# Altium schematic sheet FT2232Circuit.SchDoc
size A3
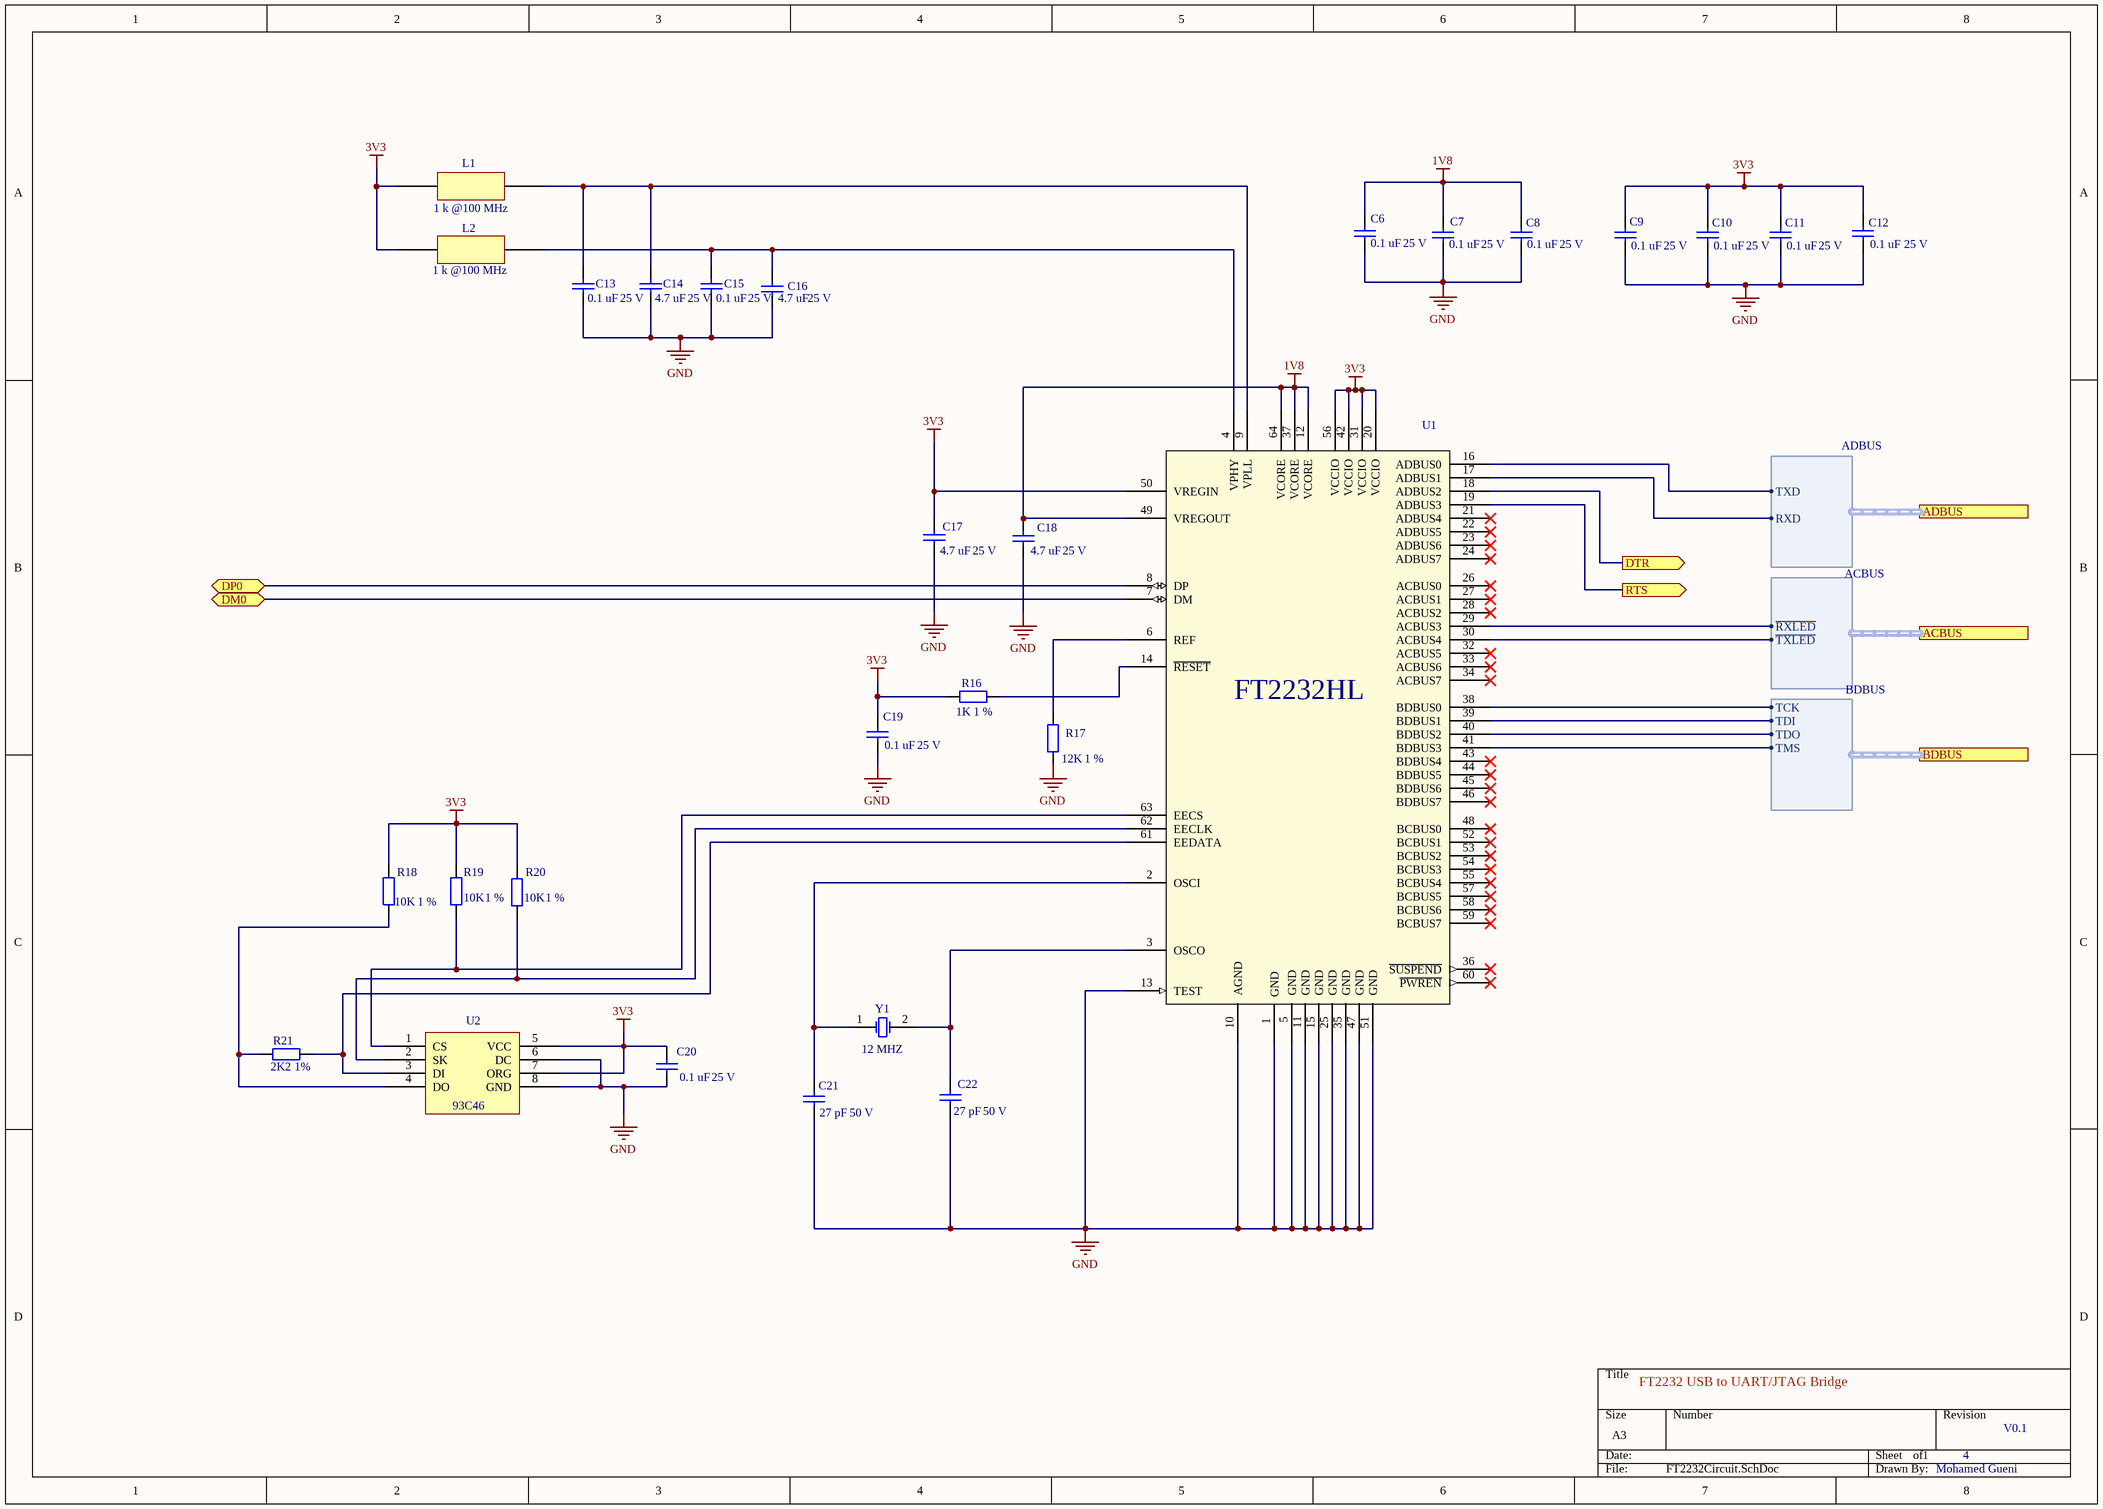
[diagram p0: FT2232Circuit.SchDoc]

## Parts
C6  Value 1: 0.1 uF  Value 2: 25 V  [CAP0603]  (hidden comment: Capacitor)
C7  Value 1: 0.1 uF  Value 2: 25 V  [CAP0603]  (hidden comment: Capacitor)
C8  Value 1: 0.1 uF  Value 2: 25 V  [CAP0603]  (hidden comment: Capacitor)
C9  Value 1: 0.1 uF  Value 2: 25 V  [CAP0603]  (hidden comment: Capacitor)
C10  Value 1: 0.1 uF  Value 2: 25 V  [CAP0603]  (hidden comment: Capacitor)
C11  Value 1: 0.1 uF  Value 2: 25 V  [CAP0603]  (hidden comment: Capacitor)
C12  Value 1: 0.1 uF  Value 2: 25 V  [CAP0603]  (hidden comment: Capacitor)
C13  Value 1: 0.1 uF  Value 2: 25 V  [CAP0603]  (hidden comment: Capacitor)
C14  Value 1: 4.7 uF  Value 2: 25 V  [CAP0603]  (hidden comment: Capacitor)
C15  Value 1: 0.1 uF  Value 2: 25 V  [CAP0603]  (hidden comment: Capacitor)
C16  Value 1: 4.7 uF  Value 2: 25 V  [CAP0603]  (hidden comment: Capacitor)
C17  Value 1: 4.7 uF  Value 2: 25 V  [CAP0603]  (hidden comment: Capacitor)
C18  Value 1: 4.7 uF  Value 2: 25 V  [CAP0603]  (hidden comment: Capacitor)
C19  Value 1: 0.1 uF  Value 2: 25 V  [CAP0603]  (hidden comment: Capacitor)
C20  Value 1: 0.1 uF  Value 2: 25 V  [CAP0603]  (hidden comment: Capacitor)
C21  Value 1: 27 pF  Value 2: 50 V  [CAP0603]  (hidden comment: Capacitor)
C22  Value 1: 27 pF  Value 2: 50 V  [CAP0603]  (hidden comment: Capacitor)
L1  Value 1: 1 k @100 MHz  [RESC3216X18N]  (hidden comment: Ferrit Bead)
L2  Value 1: 1 k @100 MHz  [RESC3216X18N]  (hidden comment: Ferrit Bead)
R16  Value 1: 1K  TOL: 1 %  [RES0603]  (hidden comment: Resistor)
R17  Value 1: 12K  TOL: 1 %  [RES0603]  (hidden comment: Resistor)
R18  Value 1: 10K  TOL: 1 %  [RES0603]  (hidden comment: Resistor)
R19  Value 1: 10K  TOL: 1 %  [RES0603]  (hidden comment: Resistor)
R20  Value 1: 10K  TOL: 1 %  [RES0603]  (hidden comment: Resistor)
R21  Value 1: 2K2  TOL: 1%  [RES0603]  (hidden comment: Resistor)
U1  FT2232HL-REEL  [TSQFP50P1200X1200X160-64N]  (value not drawn)
U2  93C46  [SOIC127P600X175-8N]  (value not drawn)
Y1  Value 1: 12 MHZ  [ABLS-12.000MHZ-B2]  (hidden comment: XTAL)

## Ports
ACBUS (harness ACBUS), ADBUS (harness ADBUS), BDBUS (harness BDBUS), DM0 (bidir), DP0 (bidir), DTR (out), RTS (out)

## Harnesses
ADBUS: TXD, RXD
ACBUS: ~{RXLED}, ~{TXLED}
BDBUS: TCK, TDI, TDO, TMS

## Nets
1V8: C6.2 C7.2 C8.2 C18.2 U1.12(VCORE) U1.37(VCORE) U1.49(VREGOUT) U1.64(VCORE)
3V3: C9.2 C10.2 C11.2 C12.2 C17.2 C19.2 C20.2 L1.2 L2.2 R16.1 R18.2 R19.2 R20.2 U1.20(VCCIO) U1.31(VCCIO) U1.42(VCCIO) U1.50(VREGIN) U1.56(VCCIO) U2.5(VCC) U2.7(ORG)
GND: C6.1 C7.1 C8.1 C9.1 C10.1 C11.1 C12.1 C13.1 C14.1 C15.1 C16.1 C17.1 C18.1 C19.1 C20.1 C21.1 C22.1 R17.1 U1.1(GND) U1.5(GND) U1.10(AGND) U1.11(GND) U1.13(TEST) U1.15(GND) U1.25(GND) U1.35(GND) U1.47(GND) U1.51(GND) U2.6(DC) U2.8(GND)
DM0: U1.7(DM) ; port DM0
DP0: U1.8(DP) ; port DP0
DTR: U1.18(ADBUS2) ; port DTR
RTS: U1.19(ADBUS3) ; port RTS
NetC13_2: C13.2 C14.2 L1.1 U1.9(VPLL)
NetC15_2: C15.2 C16.2 L2.1 U1.4(VPHY)
NetC21_2: C21.2 U1.2(OSCI) Y1.1(OSC1)
NetC22_2: C22.2 U1.3(OSCO) Y1.2(OSC2)
NetR16_2: R16.2 U1.14(~{RESET})
NetR17_2: R17.2 U1.6(REF)
NetR18_1: R18.1 R21.1 U2.4(DO)
NetR19_1: R19.1 U1.63(EECS) U2.1(CS)
NetR20_1: R20.1 U1.62(EECLK) U2.2(SK)
NetR21_2: R21.2 U1.61(EEDATA) U2.3(DI)
NetU1_16: U1.16(ADBUS0) ; port ADBUS.TXD
NetU1_17: U1.17(ADBUS1) ; port ADBUS.RXD
NetU1_29: U1.29(ACBUS3) ; port ACBUS.~{RXLED}
NetU1_30: U1.30(ACBUS4) ; port ACBUS.~{TXLED}
NetU1_38: U1.38(BDBUS0) ; port BDBUS.TCK
NetU1_39: U1.39(BDBUS1) ; port BDBUS.TDI
NetU1_40: U1.40(BDBUS2) ; port BDBUS.TDO
NetU1_41: U1.41(BDBUS3) ; port BDBUS.TMS

Not connected (* = marked no-connect by the designer): U1 21(ADBUS4)* 22(ADBUS5)* 23(ADBUS6)* 24(ADBUS7)* 26(ACBUS0)* 27(ACBUS1)* 28(ACBUS2)* 32(ACBUS5)* 33(ACBUS6)* 34(ACBUS7)* 36(~{SUSPEND})* 43(BDBUS4)* 44(BDBUS5)* 45(BDBUS6)* 46(BDBUS7)* 48(BCBUS0)* 52(BCBUS1)* 53(BCBUS2)* 54(BCBUS3)* 55(BCBUS4)* 57(BCBUS5)* 58(BCBUS6)* 59(BCBUS7)* 60(~{PWREN})*

## Notes on the sheet
- FT2232 USB to UART/JTAG Bridge
- 1
- 4
- V0.1
- Mohamed Gueni
- (in symbol U-001) FT2232HL

## Library data of the parts
C6-C13 C15 C19 C20 = CAP-0005: DES: Multilayer Ceramic Capacitors MLCC - SMD/SMT SOFT 0603 25V 0.1uF X8R 10% AEC-Q200; MAN: TDK; MANREF: CGA3E2X8R1E104K080AE; SUP: Mouser; SUPREF: 810-CGA3E2X8R1E104KA; TOL: 10 %; N°: CAP-0005; Footprint: 0603; DataSheet: https://eu.mouser.com/datasheet/2/400/lcc_automotive_soft_en-843922.pdf
C14 C16-C18 = CAP-0001: DES: Multilayer Ceramic Capacitors MLCC - SMD/SMT 0603 25Vdc 4.7uF X6S 10%; MAN: Murata Electronics; MANREF: GRT188C81E475KE13D; SUP: Mouser; SUPREF: 81-GRT188C81E475KE3D; TOL: 10%; N°: CAP-0001; Footprint: 0603; DataSheet: https://eu.mouser.com/datasheet/2/281/product-794242.pdf
C21 C22 = CAP-0017: DES: Multilayer Ceramic Capacitors MLCC - SMD/SMT 50V 27pF 0603 X7R 5%; MAN: KEMET; MANREF: C0603C270J5RACTU; SUP: Mouser; SUPREF: 80-C0603C270J5R; TOL: 5 %; N°: CAP-0017; Footprint: 0603; DataSheet: https://eu.mouser.com/datasheet/2/212/KEM_C1002_X7R_SMD-1102033.pdf
L1 L2 = L-0001: N°: L-0001; DES: Ferrite Beads 1000ohms 0.3ohms 0.8A; MAN: TDK; MANREF: MPZ1608S102A; SUP: Mouser; SUPREF: 810-MPZ1608S102A; Value 2: 800 mA; Footprint: 0603 (1608 metric); DataSheet: https://eu.mouser.com/datasheet/2/400/eads_commercial_power_mpz1608_en-923650.pdf
R16 = RES-0001: DES: Thick Film Resistors - SMD 0603 1K 1% High VoltageAEC-Q200; MAN: ROHM Semiconductor; MANREF: KTR03EZPF1001; SUP: Mouser; SUPREF: 755-KTR03EZPF1001; N°: RES-0001; DataSheet: https://eu.mouser.com/datasheet/2/348/ktr-e-1139187.pdf; Footprint: 0603
R17 = RES-0010: DES: Thick Film Resistors - SMD 0603 12K 1%; MAN: Kamaya / Kamaya; MANREF: RMC1/16K1202FTP; SUP: Mouser; SUPREF: 791-RMC1/16-123FTP; Value 2: 100 mW; N°: RES-0010; DataSheet: https://eu.mouser.com/datasheet/2/210/kamaya_products(RMC)_english_20170424_100617-1524908.pdf; Footprint: 0603
R18-R20 = RES-0011: DES: Thick Film Resistors - SMD 0603 10K 1%; MAN: Kamaya / Kamaya; MANREF: RMC1/16K1002FTP; SUP: Mouser; SUPREF: 791-RMC1/16-103FTP; Value 2: 100 mW; N°: RES-0011; DataSheet: https://eu.mouser.com/datasheet/2/210/kamaya_products(RMC)_english_20170424_100617-1524908.pdf; Footprint: 0603
R21 = RES-0014: DES: Thick Film Resistors - SMD 1/10Watt 2.2Kohms 5% Commercial Use; MAN: Vishay; MANREF: CRCW06032K20JNEAC; SUP: Mouser; SUPREF: 71-CRCW06032K20JNEAC; Value 2: 100 mW; N°: RES-0014; DataSheet: https://eu.mouser.com/datasheet/2/427/crcwce3-1223726.pdf; Footprint: 0603
U1 = U-001: IC USB HS DUAL UART/FIFO 64-LQFP; N°: U-001; DES: USB Interface IC USB HS to Dual UART/ FIFO/SPI/JTAG/I2C; MAN: FTDI; SUP: Mouser; SUPREF: 895-FT2232HL; DataSheet: https://eu.mouser.com/datasheet/2/163/DS_FT2232H-17353.pdf; MANREF: FT2232HL-REEL; Footprint: LQFP-64
U2 = U-002: EEPROM 64x16; N°: U-002; MAN: Microchip Technology; MANREF: 93C46B-I/SN; SUP: Mouser; SUPREF: 579-93C46B-I/SN; DES: EEPROM 64x16; DataSheet: https://eu.mouser.com/datasheet/2/268/20001749K-277859.pdf; Footprint: SOIC-8
Y1 = Y-0001: Crystal Oscillator; N°: Y-0001; TOL: 20 PPM; DES: Crystals +/-20ppm 12 MHZ FUNDAMENTAL; MAN: ABRACON / Ecliptek; MANREF: ABLS-12.000MHZ-B2-T; SUP: Mouser; SUPREF: 815-ABLS-12-B2; Value 2: 18 pF; Published: 8-Jun-2000; LatestRevisionDate: 17-Jul-2002; LatestRevisionNote: Re-released for DXP Platform.; PackageReference: R38; Publisher: Altium Limited; PackageDescription: Crystal, Thru-Hole; 2 Leads; Body 3.1 x 8.2 mm (Dia.xH); Footprint: HC-49/US; DataSheet: https://eu.mouser.com/datasheet/2/3/abls-44621.pdf